# Altium schematic sheet Slave1.SchDoc
size A4; SheetNumber: 4; SheetTotal: 7
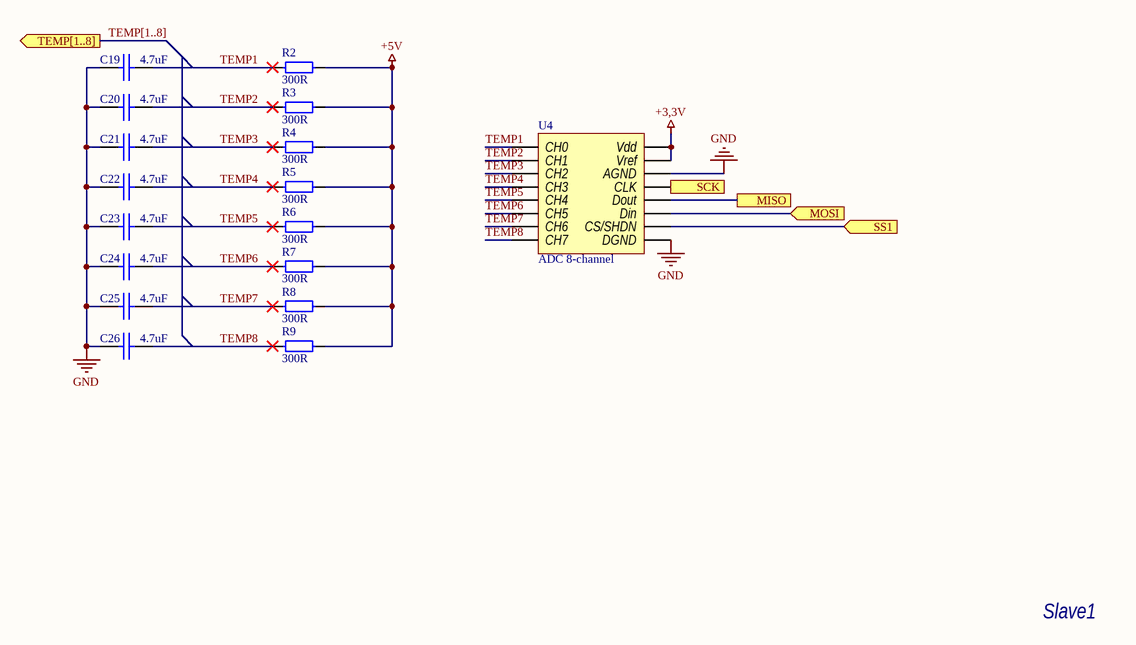
[diagram p0: Slave1.SchDoc]

## Parts
C19  4.7uF  [0603 Capicator]
C20  4.7uF  [0603 Capicator]
C21  4.7uF  [0603 Capicator]
C22  4.7uF  [0603 Capicator]
C23  4.7uF  [0603 Capicator]
C24  4.7uF  [0603 Capicator]
C25  4.7uF  [0603 Capicator]
C26  4.7uF  [0603 Capicator]
R2  300R  [0603 Resistor]
R3  300R  [0603 Resistor]
R4  300R  [0603 Resistor]
R5  300R  [0603 Resistor]
R6  300R  [0603 Resistor]
R7  300R  [0603 Resistor]
R8  300R  [0603 Resistor]
R9  300R  [0603 Resistor]
U4  ADC 8-channel  [SOIC-16]

## Ports
MISO, MOSI (in), SCK, SS1 (in), TEMP[1..8] (out)

## Nets
+3,3V: U4.15(Vref) U4.16(Vdd)
+5V: R2.2 R3.2 R4.2 R5.2 R6.2 R7.2 R8.2 R9.2
GND: C19.1 C20.1 C21.1 C22.1 C23.1 C24.1 C25.1 C26.1 U4.9(DGND) U4.14(AGND)
MISO: U4.12(Dout) ; port MISO
MOSI: U4.11(Din) ; port MOSI
SCK: U4.13(CLK) ; port SCK
SS1: U4.10(CS/SHDN) ; port SS1
TEMP1: C19.2 R2.1 U4.1(CH0)
TEMP2: C20.2 R3.1 U4.2(CH1)
TEMP3: C21.2 R4.1 U4.3(CH2)
TEMP4: C22.2 R5.1 U4.4(CH3)
TEMP5: C23.2 R6.1 U4.5(CH4)
TEMP6: C24.2 R7.1 U4.6(CH5)
TEMP7: C25.2 R8.1 U4.7(CH6)
TEMP8: C26.2 R9.1 U4.8(CH7)

## Buses and harness runs
bus TEMP[1..8] = port TEMP[1..8]

## Notes on the sheet
- Slave1

## Library data of the parts
C19-C26 = Cap 4.7uF (0603): 4.7uF X5R 25V 10% 0603; Manufacturer: Murata Manufacturing; Part Number: GRM188R61E475KE11D; Type: Capacitor; ComponentLink1Description: Chip&Dip; ComponentLink1URL: https://www.chipdip.ru/product0/9000348448
R2-R9 = Res 300R (0603): 0.1W 0603 300R, 1%; Part Number: RC0603FR-07360RL; Manufacturer: Taiwan; Type: Resistor; ComponentLink1Description: Chip&Dip; ComponentLink1URL: https://www.chipdip.ru/product0/9000079629
U4 = MCP3008-I/SL: A/D converter with SPI serial interface; Manufacturer: Microchip; Part Number: MCP3008-I/SL; Type: IC; ComponentLink1Description: ChipDip; ComponentLink1URL: https://www.chipdip.ru/product/mcp3008-i-sl; ComponentLink2Description: Datadheet; ComponentLink2URL: https://static.chipdip.ru/lib/527/DOC011527685.pdf